# EAGLE design 1ButtonSwitch.ItsyBitsyM0.Rev1.0 (EAGLE 8.6.0)
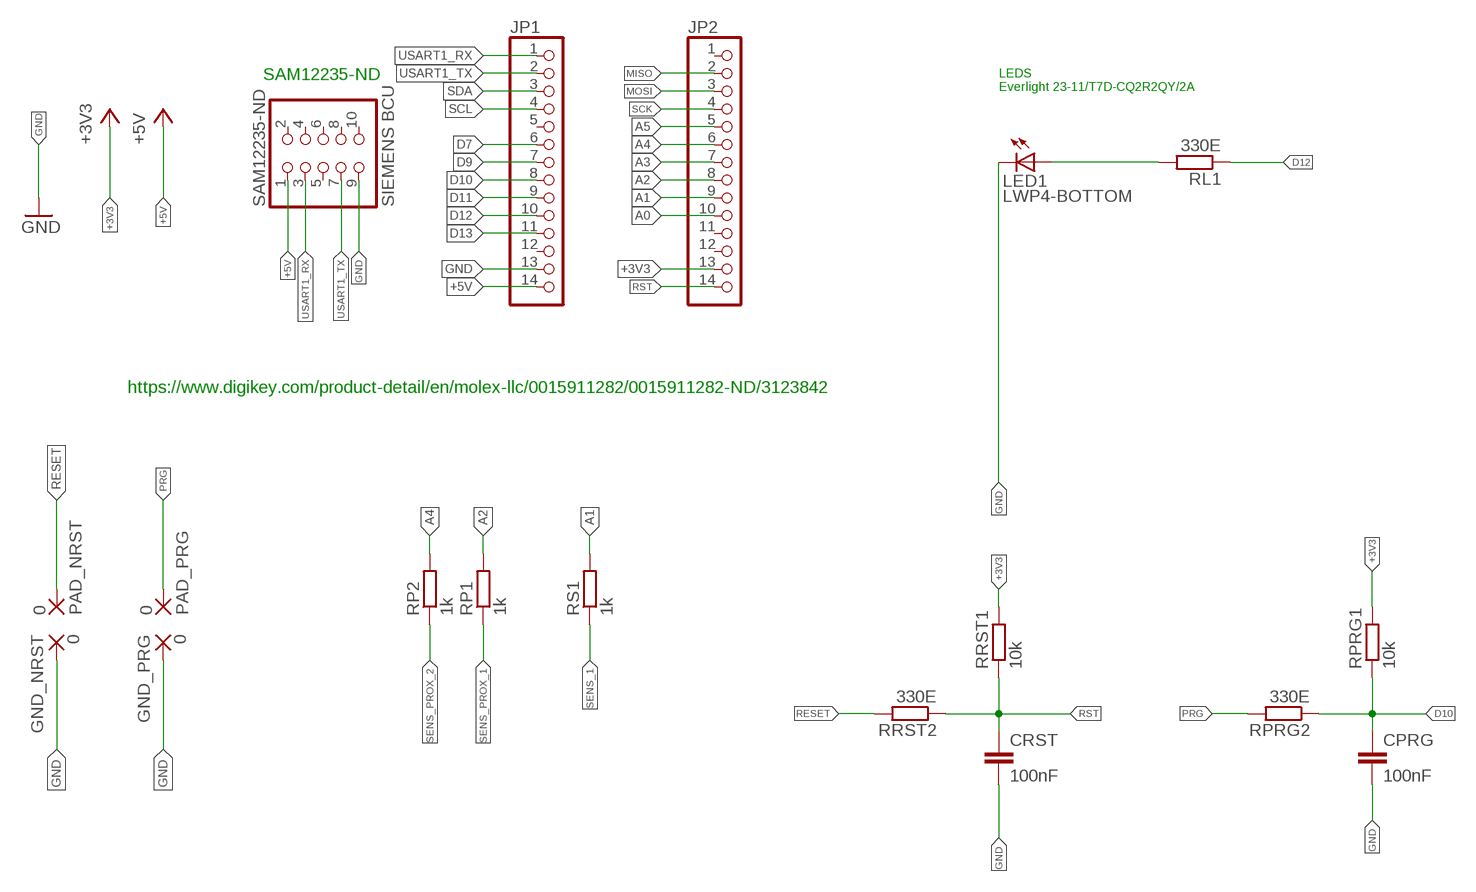
[diagram p0: schematic, sheet 1]

## Parts
CPRG  100nF  C-EUC1206  [C1206]
CRST  100nF  C-EUC1206  [C1206]
GND_NRST  0  SMD5  [SMD2,54-5,08]
GND_PRG  0  SMD5  [SMD2,54-5,08]
JP1  PINHD-1X141X14_SMT  [1X14_SMT]
JP2  PINHD-1X141X14_SMT  [1X14_SMT]
LED1  LWP4-BOTTOM  [P47F-BOTTOM]
PAD_NRST  0  SMD5  [SMD2,54-5,08]
PAD_PRG  0  SMD5  [SMD2,54-5,08]
RL1  330E  R-EU_R1206  [R1206]
RP1  1k  R-EU_R1206  [R1206]
RP2  1k  R-EU_R1206  [R1206]
RPRG1  10k  R-EU_R1206  [R1206]
RPRG2  330E  R-EU_R1206  [R1206]
RRST1  10k  R-EU_R1206  [R1206]
RRST2  330E  R-EU_R1206  [R1206]
RS1  1k  R-EU_R1206  [R1206]
SAM12235-ND  SIEMENS BCU  PINHD-2X5_2.54-SMD  [2X05SMD]

## Nets
+3V3: JP2.13 RPRG1.2 RRST1.2
+5V: JP1.14 SAM12235-ND.1
A0: JP2.10
A1: JP2.9 RS1.2
A2: JP2.8 RP1.2
A3: JP2.7
A4: JP2.6 RP2.2
A5: JP2.5
D7: JP1.6
D9: JP1.7
D10: CPRG.1 JP1.8 RPRG1.1 RPRG2.1
D11: JP1.9
D12: JP1.10 RL1.1
D13: JP1.11
GND: CPRG.2 CRST.2 GND_NRST.1(P) GND_PRG.1(P) JP1.13 LED1.C SAM12235-ND.9
MISO: JP2.2
MOSI: JP2.3
N$19: LED1.A RL1.2
PRG: PAD_PRG.1(P) RPRG2.2
RESET: PAD_NRST.1(P) RRST2.2
RST: CRST.1 JP2.14 RRST1.1 RRST2.1
SCK: JP2.4
SCL: JP1.4
SDA: JP1.3
SENS_1: RS1.1
SENS_PROX_1: RP1.1
SENS_PROX_2: RP2.1
USART1_RX: JP1.1 SAM12235-ND.3
USART1_TX: JP1.2 SAM12235-ND.7
Unconnected: JP1.5 JP1.12 JP2.1 JP2.11 JP2.12 SAM12235-ND.2 SAM12235-ND.4 SAM12235-ND.5 SAM12235-ND.6 SAM12235-ND.8 SAM12235-ND.10

## Notes on the sheet
- SAM12235-ND
- LEDS
  Everlight 23-11/T7D-CQ2R2QY/2A
- https://www.digikey.com/product-detail/en/molex-llc/0015911282/0015911282-ND/3123842

## Library data of the parts
CPRG CRST = rcl:C-EU: CAPACITOR, European symbol; SPICEPREFIX: C
GND_NRST GND_PRG PAD_NRST PAD_PRG = wirepad:SMD5: SMD PAD
JP1 JP2 = pinhead+:PINHD-1X14: PIN HEADER
LED1 = led:*P4: PointLED® Enhanced Thinfilm LED TOP & BOTTOM mount LS P47F, LR P47F, LA P47F, LY P47F, LT P4SG, LB P4SG, LW P4SG Source: http://catalog.osram-os.com .. LA_LR_LS_LY_P47F_Pb_free.pdf
RL1 RP1 RP2 RPRG1 RPRG2 RRST1 RRST2 RS1 = resistor:R-EU_: RESISTOR, European symbol
SAM12235-ND = pinhead:PINHD-2X5: PIN HEADER

## Board
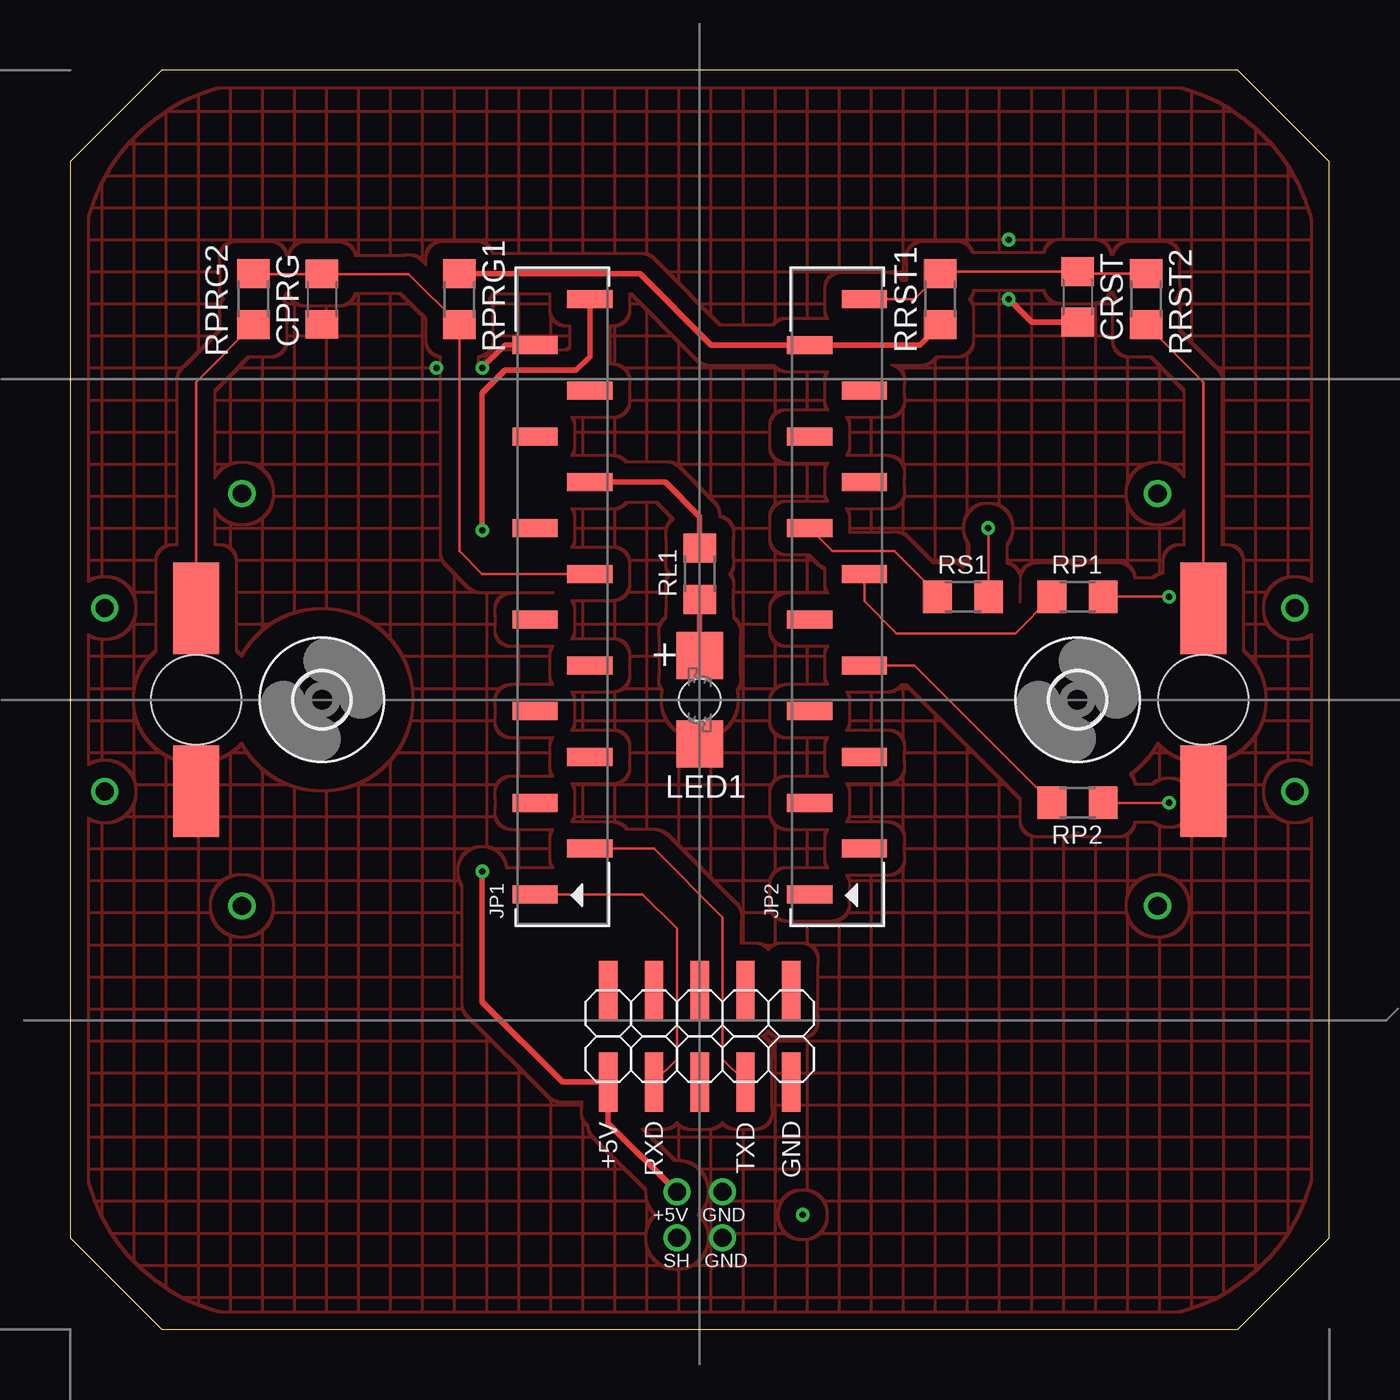
[diagram p1: board, top side]
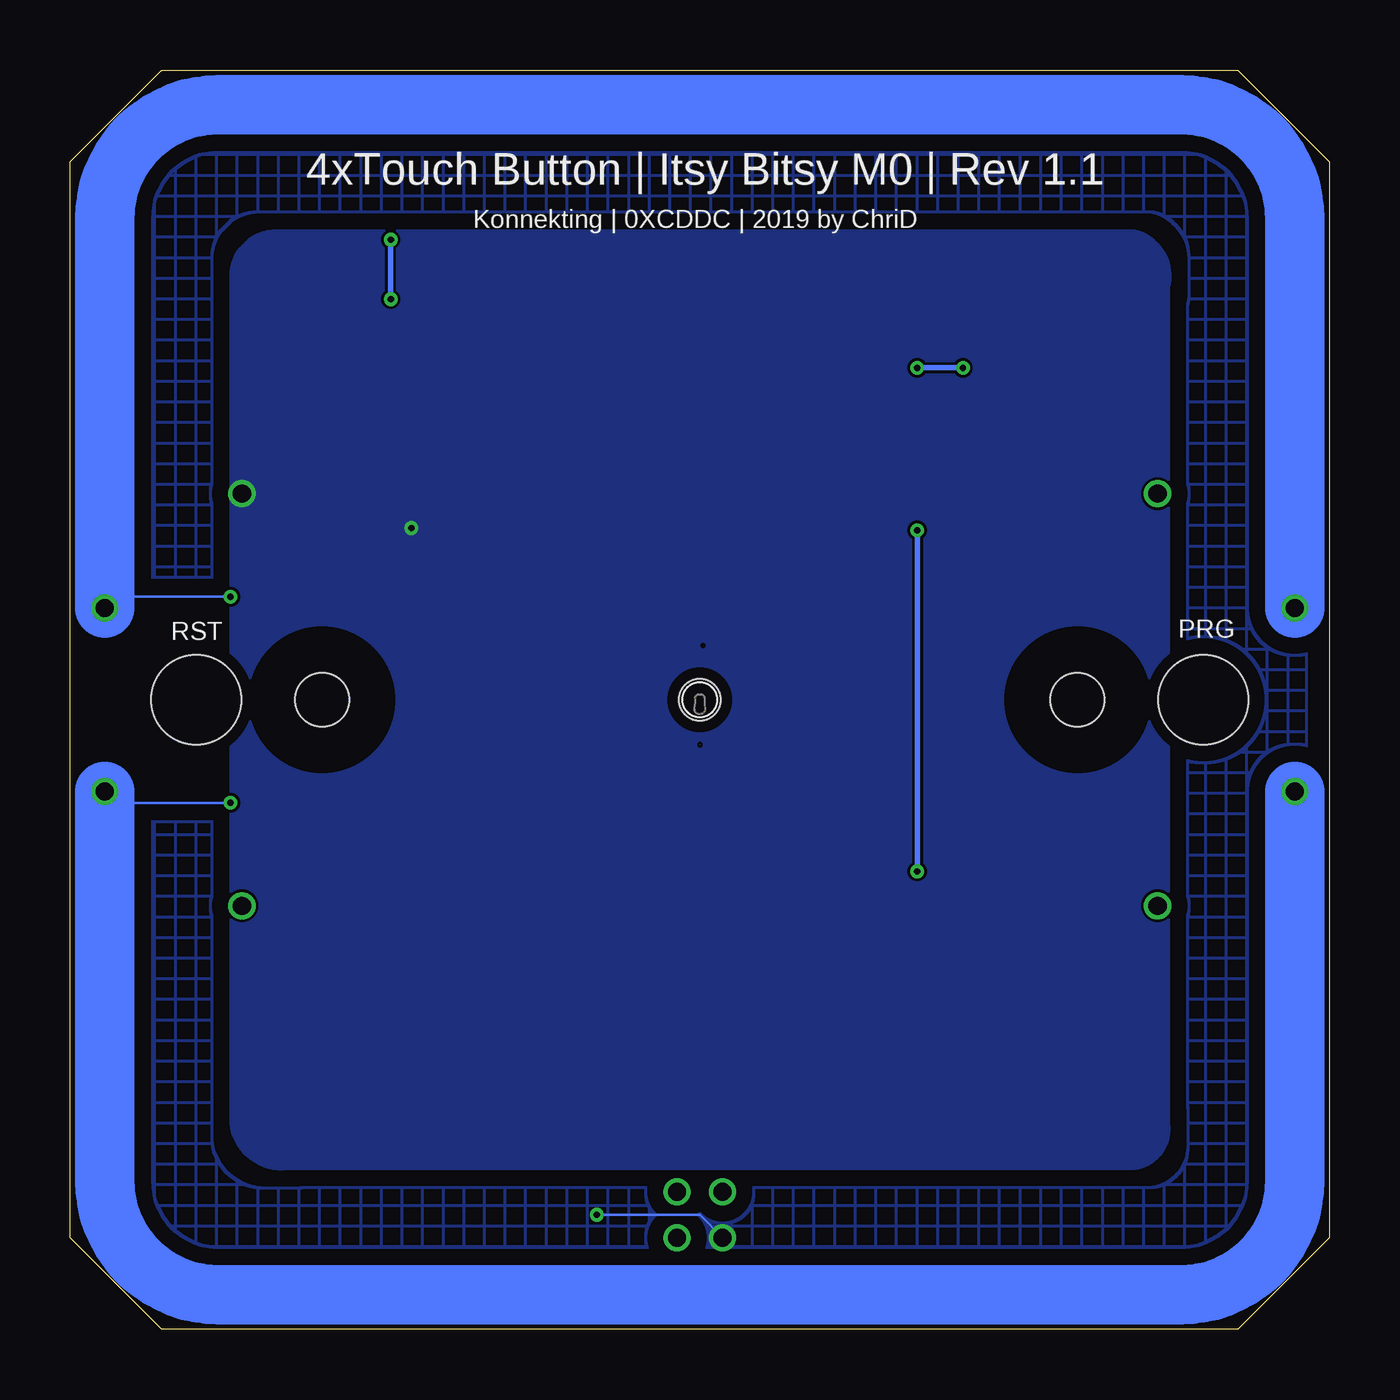
[diagram p2: board, bottom side, seen from below]

Size 69.85 x 69.85 mm. Coordinates in mm from the lower left corner, seen from the top.
Outline: 5.08,69.85 64.77,69.85 69.85,64.77 69.85,5.08 64.77,0 5.08,0 0,5.08 0,64.77 5.08,69.85
Outline: 6.34,69.84 5.08,69.85
Copper layers (1*16): Top 0.035mm / dielectric 1.5mm / Bottom 0.035mm
Design rules "konnektduino": minimum track width 6mil, minimum drill 0.35mm, track to track 6mil, track to pad 6mil, pad to pad 6mil, via to via 6mil, smd to smd 6mil, copper to edge 25mil, drill to drill 6mil, minimum pad ring 10mil, minimum via ring 8mil, stop-mask expansion 1mil, vias tented up to drill 25mil, thermal gap 10mil
Holes 5 mm at 62.87,34.92 6.99,34.92

### Footprints (pad centres in the part's own frame; a part is rotated, then mirrored left to right if it is on the bottom)
C1206 = smd 1.6 x 1.8: 1 -1.4,0; 2 1.4,0
SMD2,54-5,08 = smd 2.54 x 5.08: 1 0,0
1X14_SMT = smd 1 x 2.5: 1 -16.51,1.52; 2 -13.97,-1.52; 3 -11.43,1.52; 4 -8.89,-1.52; 5 -6.35,1.52; 6 -3.81,-1.52; 7 -1.27,1.52; 8 1.27,-1.52; 9 3.81,1.52; 10 6.35,-1.52; 11 8.89,1.52; 12 11.43,-1.52; 13 13.97,1.52; 14 16.51,-1.52
P47F-BOTTOM = smd 2.6 x 2.6: A -2.45,0; C 2.45,0 | hole 2.3: 0,0
R1206 = smd 1.6 x 1.803: 1 -1.422,0; 2 1.422,0
2X05SMD = smd 1.016 x 3.302: 1 -1.27,-3.81; 2 -1.27,1.27; 3 1.27,-3.81; 4 1.27,1.27; 5 3.81,-3.81; 6 3.81,1.27; 7 6.35,-3.81; 8 6.35,1.27; 9 8.89,-3.81; 10 8.89,1.27
3,0 = hole 3: 0,0

### Placement (x,y rotation side)
CPRG  13.97,57.15 270 top
CRST  55.88,57.28 270 top
GND_NRST  6.99,29.84 0 top
GND_PRG  62.87,29.84 0 top
JP1  27.3,40.64 90 top
JP2  42.55,40.64 90 top
LED1  34.92,34.92 270 top
PAD_NRST  62.87,40.01 0 top
PAD_PRG  6.99,40.01 0 top
RL1  34.92,41.91 270 top
RP1  55.88,40.64 180 top
RP2  55.88,29.21 180 top
RPRG1  21.59,57.15 90 top
RPRG2  10.16,57.15 270 top
RRST1  48.26,57.15 270 top
RRST2  59.69,57.15 270 top
RS1  49.53,40.64 180 top
SAM12235-ND  31.11,17.53 0 top
U$1  [3,0]  13.97,34.92 0 top
U$2  [3,0]  55.88,34.92 0 top

### Tracks (layer width: path | path; a pad name or v marks a point on that pad's centre or on a via)
+3V3
  Top 0.305: RRST1.2 47.14,54.61 JP2.13 35.56,54.61 31.6,58.57 RPRG1.2
+5V  (via drill 0.35, 1)
  Top 0.305: JP1.14 28.82,53.97 28.07,53.21 24.13,53.21 22.86,51.94 v22.86,44.32 | v22.86,25.4 22.86,18.16 27.3,13.72 SAM12235-ND.1 29.84,11.43 v33.66,7.62
  Bottom 0.305: v22.86,44.32 v22.86,25.4
A1
  Top 0.152: JP2.9 42.3,43.18 45.72,43.18 48.11,40.79 RS1.2
A2
  Top 0.152: JP2.8 44.06,40.39 45.85,38.61 52.43,38.61 RP1.2
A4
  Top 0.152: JP2.6 46.84,36.83 RP2.2
D10
  Top 0.152: RPRG2.1 10.18,58.55 CPRG.1 18.77,58.55 RPRG1.1 21.59,43.18 22.86,41.91 JP1.8
D12
  Top 0.305: RL1.1 34.92,45.09 33.02,46.99 JP1.10
GND  (via drill 0.35, 1)
  Top 0.305: JP1.13 24.13,54.61 v22.86,53.34 | CRST.2 53.34,55.88 v52.07,57.15
  Bottom 0.305: v22.86,53.34 v20.32,53.34 | v52.07,57.15 v52.07,60.45
  other vias: 36.2,7.62 36.2,5.08
  pour Top (isolate 0.889, rank 6, no thermals, hatched): 0.64,10.79 arc90 10.79,0.64 59.05,0.64 arc90 69.22,10.79 69.22,59.05 arc90 59.05,69.22 10.79,69.22 arc90 0.64,59.05
N$19
  Top 0.305: RL1.2 LED1.A
PRG
  Top 0.152: PAD_PRG.1 6.99,52.55 RPRG2.2
RESET
  Top 0.152: PAD_NRST.1 62.87,52.55 RRST2.2
RST
  Top 0.152: RRST2.1 55.99,58.57 CRST.1 48.37,58.68 RRST1.1 46.84,57.15 JP2.14
SENS_1  (via drill 0.35, 1)
  Top 0.152: RS1.1 50.95,44.42 v50.93,44.45
  other vias: 60.33,46.35
  pour Bottom: 8.89,57.78 8.89,11.43 arc90 10.79,8.89 57.78,8.89 arc90 60.96,11.43 60.96,58.42 arc90 58.42,60.96 10.79,60.96 arc90
SENS_2  (via drill 1)
  other vias: 9.53,46.35
SENS_3  (via drill 1)
  other vias: 60.33,23.5
SENS_4  (via drill 1)
  other vias: 9.53,23.5
SENS_PROX_1  (via drill 0.35, 1)
  Top 0.152: RP1.1 v60.96,40.64
  Bottom 0.152: v60.96,40.64 67.31,40.64 v67.94,40.01
  Bottom 3.302: v1.91,40.01 1.91,61.59 arc-90 8.26,67.94 61.59,67.94 arc-90 67.94,61.59 v67.94,40.01
SENS_PROX_2  (via drill 0.35, 1)
  Top 0.152: RP2.1 v60.96,29.21
  Bottom 0.152: v60.96,29.21 67.31,29.21 v67.94,29.84
  Bottom 3.302: v1.91,29.84 1.91,8.26 arc90 8.26,1.91 61.59,1.91 arc90 67.94,8.26 v67.94,29.84
SHIELD_OR_GND  (via drill 0.35, 1)
  Bottom 0.152: v33.66,5.08 34.92,6.35 v40.64,6.35
  pour Bottom (isolate 0.889, rank 6, no thermals, hatched): 1.27,6.99 arc90 6.99,1.27 61.59,2.54 arc90 67.31,8.26 67.31,61.59 arc90 61.59,67.31 6.99,67.31 arc90 1.27,61.59
USART1_RX
  Top 0.152: JP1.1 31.75,24.13 33.66,22.23 33.66,14.99 SAM12235-ND.3
USART1_TX
  Top 0.152: SAM12235-ND.7 36.2,14.99 36.2,22.86 32.38,26.67 JP1.2

### Text on the board
tNames: + | +5V | RXD | TXD | GND | +5V | GND | SH | GND
bNames: 4xTouch Button | Itsy Bitsy M0 | Rev 1.1 | Konnekting | 0XCDDC | 2019 by ChriD | PRG | RST